# Altium schematic sheet [7] TSAL_Red.SchDoc
size A4
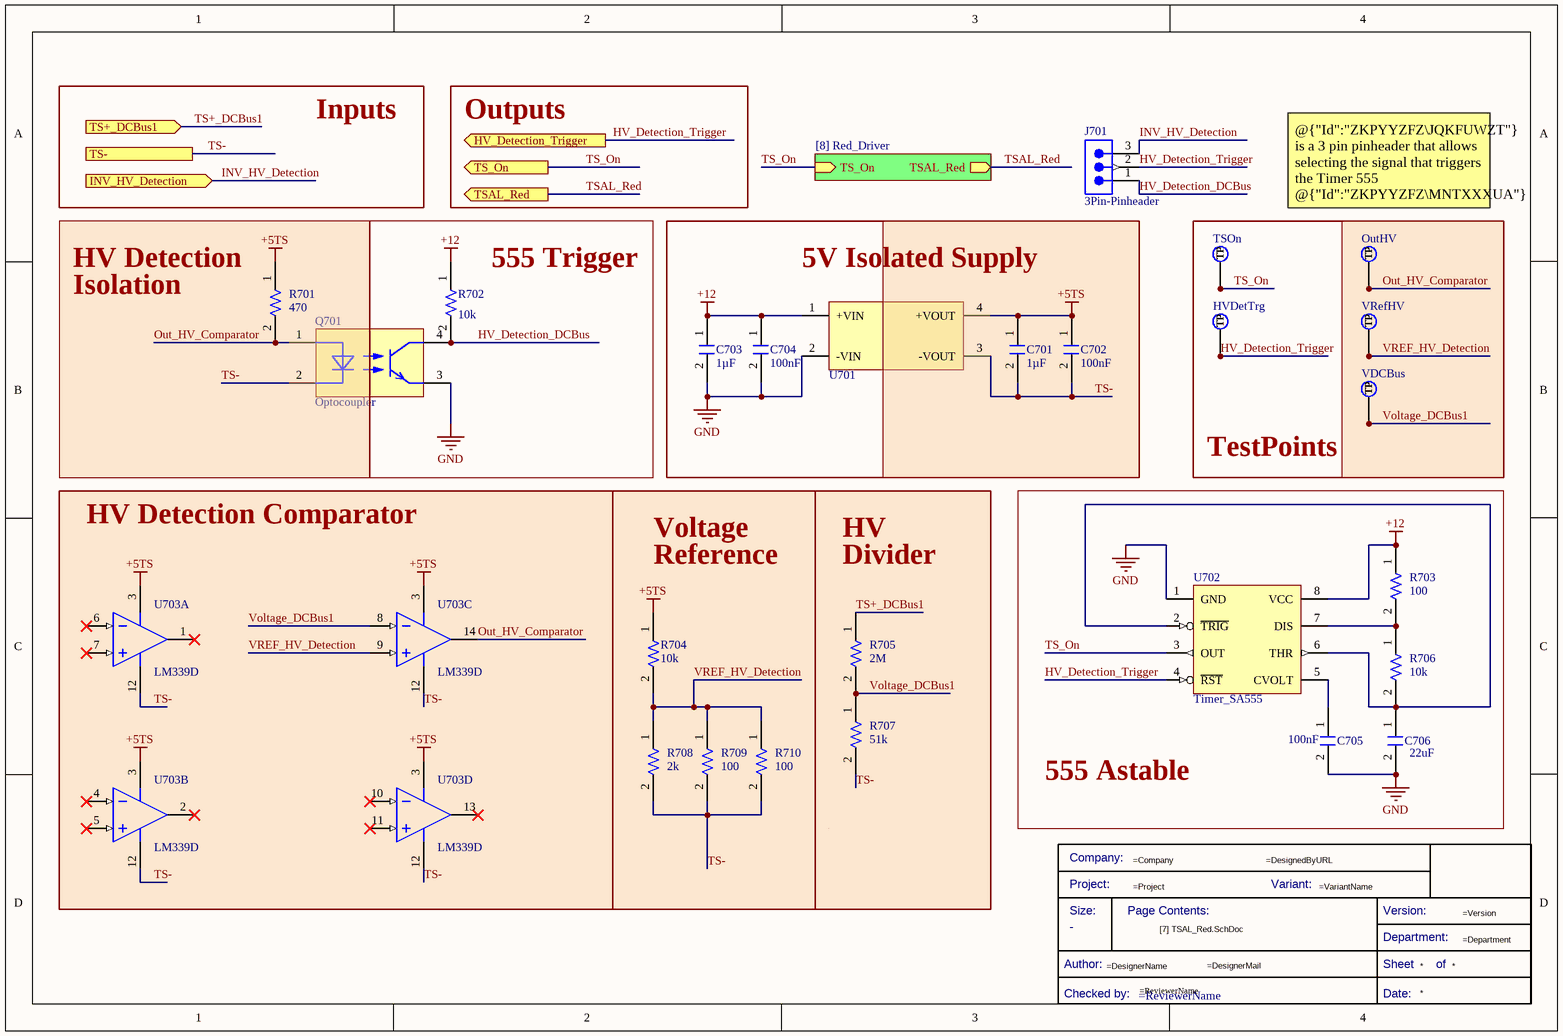
[diagram p0: [7] TSAL_Red.SchDoc]

## Parts
*  Title Block_template  (value not drawn)  (graphical)
C701  value 1µF  [C0805FNPC-R]  (hidden comment: C1u-50V-0805FNPC-X7R)
C702  Capacitance: 100nF  [WCAP-CSGP_0805_L2W1.25H0.8_Reflow]  (hidden comment: C100n-16V-0805)
C703  value 1µF  [C0805FNPC-R]  (hidden comment: C1u-50V-0805FNPC-X7R)
C704  Capacitance: 100nF  [WCAP-CSGP_0805_L2W1.25H0.8_Reflow]  (hidden comment: C100n-16V-0805)
C705  value 100nF  [WCAP-CSGP_0805_L2W1.25H0.8_Reflow]  (hidden comment: C100n-16V-0805)
C706  value 22uF  [WCAP-CSGP_0805_L2W1.25H0.8_Reflow]  (hidden comment: C22u-25V-0805)
HVDetTrg  TestPoint  [TestPoint]  (value not drawn)  (no BOM)
J701  3Pin-Pinheader  [61300311121]
OutHV  TestPoint  [TestPoint]  (value not drawn)  (no BOM)
Q701  Optocoupler  [WL-OCPT_LSOP4]
R701  value 470  [R0805FTK]  (hidden comment: R470-0805FTK)
R702  value 10k  [R0805FTK]  (hidden comment: R10k-0805FTK)
R703  value 100  [R0805FTK]  (hidden comment: R100-0805FTK)
R704  Resistance: 10k  [0805]  (hidden comment: R10k_0805_0.25W)
R705  Resistance: 2M  [R2512FTK]  (hidden comment: R2M-2512FTK)
R706  value 10k  [R0805FTK]  (hidden comment: R10k-0805FTK)
R707  value 51k  [0805]  (hidden comment: R51k_0805)
R708  value 2k  [0805]  (hidden comment: R2K_0.5W_0805)
R709  value 100  [R0805FTK]  (hidden comment: R100-0805FTK)
R710  value 100  [R0805FTK]  (hidden comment: R100-0805FTK)
TSOn  TestPoint  [TestPoint]  (value not drawn)  (no BOM)
U701  DCDC_ISO_12VIN_5VOUT  [WPME-FISM_SIP-7_L19.65W7.05H10.16]  (value not drawn)
U702  Timer_SA555  [Timer_SA555]
U703  LM339D  [D0014A_N]  (parts A,B,C,D of 4)
VDCBus  TestPoint  [TestPoint]  (value not drawn)  (no BOM)
VRefHV  TestPoint  [TestPoint]  (value not drawn)  (no BOM)

## Blocks framed on the sheet
555 Trigger: Q701 R702
5V Isolated Supply: C701-C704 U701
TestPoints: HVDetTrg OutHV TSOn VDCBus VRefHV
HV Detection Comparator: U703
555 Astable: C705 C706 R703 R706 U702

## Sub-sheets
Red Driver = [8] Red_Driver: TS_On (in), TSAL_Red (out)

## Ports
HV_Detection_Trigger (out, see TSAL_Control[1D], [1] TSAL_Green[2B], [2] Implausibilities[1A], [5] SCS[1A]), INV_HV_Detection (in, see TSAL_Control[1D]), TS+_DCBus1 (in, see TSAL_Control[1C]), TS- (see TSAL_Control[1D]), TS_On (out, see TSAL_Control[1D], [8] Red_Driver[1A]), TSAL_Red (out, see TSAL_Control[1C], [1] TSAL_Green[3A], [2] Implausibilities[1A], [5] SCS[1B], [8] Red_Driver[2A])

## Nets
+5TS: C701.1 C702.1 R701.1 R704.1 U701.4(+VOUT) U703.3(VCC)
+12: C703.1 C704.1 R702.1 R703.1 U701.1(+VIN) U702.8(VCC)
GND: C703.2 C704.2 C705.2 C706.2 Q701.3(Emitter) U701.2(-VIN) U702.1(GND)
HV_Detection_DCBus: J701.1 Q701.4(Collector) R702.2
HV_Detection_Trigger: HVDetTrg.1(TP) J701.2 U702.4(~{RST}) ; port HV_Detection_Trigger
INV_HV_Detection: J701.3 ; port INV_HV_Detection
Out_HV_Comparator: OutHV.1(TP) Q701.1(Anode) R701.2 U703.14(OUT3)
TS+_DCBus1: R705.1 ; port TS+_DCBus1
TS-: C701.2 C702.2 Q701.2(Cathode) R707.2 R708.2 R709.2 R710.2 U701.3(-VOUT) U703.12(GND) ; port TS-
TS_On: TSOn.1(TP) U702.3(OUT) ; port TS_On, sheet Red Driver/TS_On
TSAL_Red: port TSAL_Red, sheet Red Driver/TSAL_Red
Voltage_DCBus1: R705.2 R707.1 U703.8(IN3-) VDCBus.1(TP)
VREF_HV_Detection: R704.2 R708.1 R709.1 R710.1 U703.9(IN3+) VRefHV.1(TP)
NetC705_1: C705.1 U702.5(CVOLT)
NetC706_1: C706.1 R706.2 U702.2(~{TRIG}) U702.6(THR)
NetR703_2: R703.2 R706.1 U702.7(DIS)

Not connected (* = marked no-connect by the designer): U703 1(OUT1)* 2(OUT2)* 4(IN2-)* 5(IN2+)* 6(IN1-)* 7(IN1+)* 10(IN4-)* 11(IN4+)* 13(OUT4)*

## Notes on the sheet
- Inputs
- Outputs
- @{"Id":"ZKPYYZFZ\JQKFUWZT"} is a 3 pin pinheader that allows selecting the signal that triggers the Timer 555 @{"Id":"ZKPYYZFZ\MNTXXXUA"} to oscillate and drive the TSAL Red.
- (near R701) HV Detection
- Isolation
- Voltage
- Reference
- HV
- Divider
- (in symbol CMP-00043-8) Company:; Project:; Variant:; Size:; Page Contents:; Version:; Department:; Author:; Sheet; of; Checked by:; Date:

## Library data of the parts
* = CMP-00043-8: Standard Title Block; .SCHcheck: GP; Checked by:: =ReviewerName; Size: -; Design Item ID: Title Block_template; .PCBcheck: GP; .Creator: GP; Source: e-Tech_Racing.SchLib; Category: Title Block
C701 C703 = CMP-00052-2: Multilayer Ceramic Capacitor, Wcap-Csgp Series, 1 F, 10%, X7R, 50 V, 0805 [2012 Metric] Rohs Compliant: Yes; Manufacturer Part Number 1: 885012207103; Manufacturer 1: Wurth Electronics; Voltage Rating (DC): 50V; .Creator: GP; Max Operating Temperature: 85°C; Case/Package: 0805; ComponentLink1Description: http://www.farnell.com/datasheets/1958501.pdf?src-supplier=Farnell; Design Item ID: C1u-50V-0805FNPC-X7R; ComponentLink1URL: http://www.farnell.com/datasheets/1958501.pdf?src-supplier=Farnell; ComponentLink2Description: http://www.farnell.com/datasheets/1958501.pdf?src-supplier=Element14; ComponentLink3URL: https://katalog.we-online.de/pbs/datasheet/885012107003.pdf?src-supplier=Digi-Key; ComponentLink4Description: http://www.farnell.com/datasheets/1958501.pdf?src-supplier=Newark; Width: 0.049inch; RoHS Compliant: Yes; Case Code (Metric): 2012; Source: Passives.SchLib; Category: Ceramic Capacitors; Tolerance: 10%; Pricing 1: 50=0,27200, 250=0,25300, 500=0,22800, 1250=0,20100, 2500=0,17100 (GBP); RoHS: Yes; Mount: Surface Mount; Min Operating Temperature: -55°C; ComponentLink4URL: http://www.farnell.com/datasheets/1958501.pdf?src-supplier=Newark; Dielectric: X7R; ComponentLink3Description: https://katalog.we-online.de/pbs/datasheet/885012107003.pdf?src-supplier=Digi-Key; ComponentLink2URL: http://www.farnell.com/datasheets/1958501.pdf?src-supplier=Element14; REACH SVHC: Unknown; Length: 0.079inch; Packaging: Cut Tape; Thickness: 0.053inch; Stock 1: 5100; Voltage Rating: 50V
C702 C704 C705 = CMP-001-00008-6: Ceramic Capacitor, Multilayer, Ceramic, 16V, 10% +Tol, 10% -Tol, X7R, 15% TC, 0.1uF, Surface Mount, 0805; Pins: 2; RoHS Compliant: Yes; Capacitor Type: Ceramic
C706 = CMP-001-00017-4: 885012107019
HVDetTrg OutHV TSOn VDCBus VRefHV = CMP-00042-2: Test Point 1x1 mm; .SCHcheck: GP; Category: TestPoint; Source: e-Tech_Racing.SchLib; .Creator: GP; .PCBcheck: GP; Design Item ID: TestPoint
J701 = CMP-002-00009-1: Board Connector, 3 Contact(s), 1 Row(s), Male, Straight, 0.1 inch Pitch, Solder Terminal, Locking, Black Insulator, Plug; RoHS Compliant: Yes; Connector Type: BOARD CONNECTOR; Max Operating Temperature: 125°C; Min Operating Temperature: -40°C; Mounting Technology: Board
Q701 = CMP-00195-1: Transistor Output Optocoupler. S/N: 140100146000; RoHS Compliant: Yes
R701 = CMP-00093-3: Res Thick Film 0805 470 Ohm 1% 1/8W ±100ppm/°C Molded SMD SMD Paper Tape on Plastic Reel; Manufacturer Part Number 1: CR0805-FX-4700GLF; Manufacturer 1: Bourns; Voltage Rating (DC): 150V; Max Power Dissipation: 125mW; .Creator: DR; ComponentLink2URL: https://datasheet.ciiva.com/7985/1856384-7985880.pdf?src-supplier=Element14; Construction: Rectangular; Max Operating Temperature: 155°C; Thickness: 508um; Pins: 2; REACH SVHC: No SVHC; Features: Moisture Resistant; Voltage Rating: 150V; Source: Passives.SchLib; Pricing 1: 1=0,00990, 10=0,00980, 25=0,00950, 50=0,00940, 100=0,00930, 250=0,00920, 500=0,00910, 1000=0,00890, 3000=0,00870, 6000=0,00860 (USD); ComponentLink4URL: https://datasheet.ciiva.com/5541/chpreztr-5541930.pdf?src-supplier=Mouser; Design Item ID: R470-0805FTK; Depth: 1.25mm; Case Code (Metric): 2012; Technology: THICK FILM; RoHS: Yes; Power Rating: 125mW; Number of Terminations: 2; ComponentLink1URL: https://datasheet.ciiva.com/11808/0900766b80fcdb72-11808686.pdf?src-supplier=RSComponents; Tolerance: 1%; Radiation Hardening: No; Packaging: Tape and Reel; Resistor Type: Thick Film; Series: CR0805; Military Standard: Not; Termination: SMD/SMT; ComponentLink3URL: https://datasheet.ciiva.com/22693/1902866-22693247.pdf?src-supplier=Element14; Min Operating Temperature: -55°C; ComponentLink4Description: https://datasheet.ciiva.com/5541/chpreztr-5541930.pdf?src-supplier=Mouser; ComponentLink3Description: https://datasheet.ciiva.com/22693/1902866-22693247.pdf?src-supplier=Element14; Stock 1: 12623; Length: 2mm; Temperature Coefficient: 100ppm/°C; Contact Plating: Tin; ComponentLink1Description: https://datasheet.ciiva.com/11808/0900766b80fcdb72-11808686.pdf?src-supplier=RSComponents; Case/Package: 0805; Category: Chip SMD Resistors; ComponentLink2Description: https://datasheet.ciiva.com/7985/1856384-7985880.pdf?src-supplier=Element14; Height: 0.5mm; Mount: Surface Mount; Resistance Tolerance: 1%
R702 R706 = CMP-00085-4: BOURNS         CR0805-JW-103ELF            Surface Mount Chip Resistor, Thick Film, CR Series, 10 kohm, 125 mW,  5%, 150 V; .Creator: DR; Power Rating: 125mW; Voltage Rating (DC): 100V; Voltage Rating: 150V; Temperature Coefficient: 200ppm/°C; ComponentLink6URL: https://datasheet.ciiva.com/16783/70154685-16783482.pdf?src-supplier=Allied+Electronics; Manufacturer 1: Bourns; Package Quantity: 1; ComponentLink10URL: https://datasheet.ciiva.com/7985/1856384-7985869.pdf?src-supplier=Element14; Technology: THICK FILM; Source: Passives.SchLib; RoHS Compliant: Yes; ComponentLink10Description: https://datasheet.ciiva.com/7985/1856384-7985869.pdf?src-supplier=Element14; ComponentLink1URL: https://datasheet.ciiva.com/11821/0900766b80fcdb72-11821135.pdf?src-supplier=RSComponents; ComponentLink7Description: https://datasheet.ciiva.com/5548/chpreztr-5548491.pdf?src-supplier=Mouser; Radiation Hardening: No; Design Item ID: R10k-0805FTK; ComponentLink4Description: https://datasheet.ciiva.com/7986/691949-7986187.pdf?src-supplier=Element14; Pins: 2; ComponentLink9URL: https://datasheet.ciiva.com/6559/chpreztr-6559901.pdf?src-supplier=Digi-Key; Resistor Type: Thick Film; ComponentLink4URL: https://datasheet.ciiva.com/7986/691949-7986187.pdf?src-supplier=Element14; Contact Plating: Tin; Case Code (Metric): 2012; Military Standard: Not; Depth: 1.25mm; Case/Package: 0805; Packaging: Tape and Reel; ComponentLink9Description: https://datasheet.ciiva.com/6559/chpreztr-6559901.pdf?src-supplier=Digi-Key; Construction: Rectangular; Pricing 1: 1=0,05790, 10=0,01540, 25=0,01340, 100=0,00340 (USD); ComponentLink7URL: https://datasheet.ciiva.com/5548/chpreztr-5548491.pdf?src-supplier=Mouser; Category: Chip SMD Resistors; Length: 2mm; Max Operating Temperature: 155°C; Resistance Tolerance: 5%; Manufacturer Part Number 1: CR0805-JW-103ELF; Height: 0.5mm; ComponentLink2URL: https://datasheet.ciiva.com/9122/chpreztr-9122374.pdf?src-supplier=Avnet; Thickness: 508um; Max Power Dissipation: 125mW; ComponentLink8Description: https://datasheet.ciiva.com/6559/chpreztr-6559900.pdf?src-supplier=Digi-Key; REACH SVHC: No SVHC; ComponentLink8URL: https://datasheet.ciiva.com/6559/chpreztr-6559900.pdf?src-supplier=Digi-Key; ComponentLink5URL: https://datasheet.ciiva.com/30065/159chpreztr-30065976.pdf?src-supplier=Onlinecomponents.com; Width: 1.25mm; ComponentLink11URL: https://datasheet.ciiva.com/48692/001055517-da-01-en-smd-wid-cr0805-jw-103elf-10k-ohm-1-8w-48692118.pdf?src-supplier=Conrad; ComponentLink3Description: https://datasheet.ciiva.com/22693/1902866-22693254.pdf?src-supplier=Element14; ComponentLink11Description: https://datasheet.ciiva.com/48692/001055517-da-01-en-smd-wid-cr0805-jw-103elf-10k-ohm-1-8w-48692118.pdf?src-supplier=Conrad; ComponentLink1Description: https://datasheet.ciiva.com/11821/0900766b80fcdb72-11821135.pdf?src-supplier=RSComponents; ComponentLink2Description: https://datasheet.ciiva.com/9122/chpreztr-9122374.pdf?src-supplier=Avnet; Stock 1: 57566; Min Operating Temperature: -55°C; Series: CR0805; Number of Terminations: 2; Termination: SMD/SMT; Tolerance: 5%; Mount: Surface Mount; ComponentLink6Description: https://datasheet.ciiva.com/16783/70154685-16783482.pdf?src-supplier=Allied+Electronics; ComponentLink5Description: https://datasheet.ciiva.com/30065/159chpreztr-30065976.pdf?src-supplier=Onlinecomponents.com; RoHS: Yes; Features: Moisture Resistant; ComponentLink3URL: https://datasheet.ciiva.com/22693/1902866-22693254.pdf?src-supplier=Element14
R703 = CMP-00083-3: Res Thick Film 0805 100 Ohm 1% 1/8W ±100ppm/°C Molded SMD SMD Paper Tape on Plastic Reel; Manufacturer Part Number 1: CR0805-FX-1000ELF; Manufacturer 1: Bourns; Power Rating: 125mW; Voltage Rating (DC): 150V; .Creator: DR; Military Standard: Not; Radiation Hardening: No; Max Operating Temperature: 155°C; Packaging: Tape and Reel; ComponentLink3Description: https://datasheet.ciiva.com/6547/chpreztr-6547414.pdf?src-supplier=Digi-Key; RoHS Compliant: Yes; ComponentLink5Description: https://datasheet.ciiva.com/9120/chpreztr-9120744.pdf?src-supplier=Avnet; ComponentLink4URL: https://datasheet.ciiva.com/6547/chpreztr-6547415.pdf?src-supplier=Digi-Key; REACH SVHC: No SVHC; Depth: 1.25mm; Case/Package: 0805; Series: CR0805; Pricing 1: 1=0,05840, 10=0,03430, 25=0,01780, 100=0,00750, 250=0,00560, 500=0,00490, 3000=0,00470 (USD); Features: Moisture Resistant; Design Item ID: R100-0805FTK; Resistor Type: Thick Film; ComponentLink3URL: https://datasheet.ciiva.com/6547/chpreztr-6547414.pdf?src-supplier=Digi-Key; Construction: Rectangular; Width: 1.25mm; ComponentLink4Description: https://datasheet.ciiva.com/6547/chpreztr-6547415.pdf?src-supplier=Digi-Key; Stock 1: 49802; ComponentLink1URL: https://datasheet.ciiva.com/11809/0900766b80fcdb72-11809178.pdf?src-supplier=RSComponents; Number of Terminations: 2; ComponentLink1Description: https://datasheet.ciiva.com/11809/0900766b80fcdb72-11809178.pdf?src-supplier=RSComponents; Length: 2mm; Min Operating Temperature: -55°C; Height: 0.5mm; Mount: Surface Mount; Max Power Dissipation: 125mW; Technology: THICK FILM; Case Code (Metric): 2012; Tolerance: 1%; Category: Chip SMD Resistors; Thickness: 508um; Source: Passives.SchLib; Resistance Tolerance: 1%; RoHS: Yes; ComponentLink5URL: https://datasheet.ciiva.com/9120/chpreztr-9120744.pdf?src-supplier=Avnet; Temperature Coefficient: 100ppm/°C; Package Quantity: 1; Pins: 2; Contact Plating: Tin; Voltage Rating: 150V; Termination: SMD/SMT; ComponentLink2Description: https://datasheet.ciiva.com/6547/chpreztr-6547413.pdf?src-supplier=Digi-Key; ComponentLink2URL: https://datasheet.ciiva.com/6547/chpreztr-6547413.pdf?src-supplier=Digi-Key
R704 = CMP-009-00035-5: Resistor, 10K, 0.25W, Thick Film, 0805 Rohs Compliant: Yes
R705 = CMP-00108-3: Current Sense Resistors - SMD 3watts .002ohms 1%; Manufacturer: Vishay Dale; Manufacturer Part Number: WSLP25122L000FEA; Power Rating: 3W; Temperature Coefficient: 275ppm/°C; Packaging: Tape and Reel; Height: 0.635mm; Weight: 0.001429oz; Case Code (Imperial): 2512; Source: Passives.SchLib; Tolerance: 1%; Termination: SMD/SMT; RoHS: Yes; Size Code: 2512; Case Code (Metric): 6432; Stock 1: 11994; ComponentLink1URL: https://datasheet.ciiva.com/48527/wslp-48527354.pdf?src-supplier=Avnet; Package Quantity: 2000; Length: 6.4mm; Resistor Type: Metal Strip; ComponentLink1Description: https://datasheet.ciiva.com/48527/wslp-48527354.pdf?src-supplier=Avnet; Design Item ID: R2M-2512FTK; Mount: Surface Mount; Width: 3.2mm; Category: Chip SMD Resistors; RoHS Compliant: Yes; Case/Package: 2512; Max Operating Temperature: 170°C; Lead Free: Lead Free; Pricing 1: 1=1,07000, 10=1,07000, 50=1,07000, 100=1,07000, 1000=0,77100, 10000=0,75500 (USD); Series: WSLP; Min Operating Temperature: -65°C
R707 = CMP-009-00018-5: Fixed Resistor, Metal Glaze/thick Film, 0.125W, 51000ohm, 150V, 1% +/-Tol, 100ppm/Cel, Surface Mount, 0805. ERJ-6ENF5102V; Power: 125mW; Mounting Technology: Surface Mount; Pins: 2; Case/Package: 0805; RoHS Compliant: Yes; Tolerance: 1%; Min Operating Temperature: -55°C; Max Operating Temperature: 155°C
R708 = CMP-009-00027-3: Fixed Resistor, Metal Glaze/thick Film, 0.5W, 2000ohm, 150V, 1% +/-Tol, 100ppm/Cel, Surface Mount, 0805; Manufacturer: Vishay; Part Number: CRCW08052K00FKEAHP; Power: 500mW; Min Operating Temperature: -55°C; Max Operating Temperature: 155°C; RoHS Compliant: Yes; Tolerance: 1%; Mounting Technology: Surface Mount; Pins: 2; Case/Package: 0805
R709 R710 = CMP-00083-3: Res Thick Film 0805 100 Ohm 1% 1/8W ±100ppm/°C Molded SMD SMD Paper Tape on Plastic Reel; Manufacturer 1: Bourns; Manufacturer Part Number 1: CR0805-FX-1000ELF; .Creator: DR; Voltage Rating: 150V; Power Rating: 125mW; Stock 1: 49802; Category: Chip SMD Resistors; Number of Terminations: 2; RoHS Compliant: Yes; Package Quantity: 1; Case/Package: 0805; Features: Moisture Resistant; Source: Passives.SchLib; Military Standard: Not; Construction: Rectangular; RoHS: Yes; Packaging: Tape and Reel; ComponentLink3URL: https://datasheet.ciiva.com/6547/chpreztr-6547414.pdf?src-supplier=Digi-Key; Resistance Tolerance: 1%; Termination: SMD/SMT; Height: 0.5mm; Radiation Hardening: No; Pricing 1: 1=0,05840, 10=0,03430, 25=0,01780, 100=0,00750, 250=0,00560, 500=0,00490, 3000=0,00470 (USD); ComponentLink2URL: https://datasheet.ciiva.com/6547/chpreztr-6547413.pdf?src-supplier=Digi-Key; ComponentLink5Description: https://datasheet.ciiva.com/9120/chpreztr-9120744.pdf?src-supplier=Avnet; Pins: 2; ComponentLink4URL: https://datasheet.ciiva.com/6547/chpreztr-6547415.pdf?src-supplier=Digi-Key; Temperature Coefficient: 100ppm/°C; Resistor Type: Thick Film; ComponentLink3Description: https://datasheet.ciiva.com/6547/chpreztr-6547414.pdf?src-supplier=Digi-Key; Width: 1.25mm; ComponentLink4Description: https://datasheet.ciiva.com/6547/chpreztr-6547415.pdf?src-supplier=Digi-Key; Length: 2mm; ComponentLink5URL: https://datasheet.ciiva.com/9120/chpreztr-9120744.pdf?src-supplier=Avnet; Case Code (Metric): 2012; Design Item ID: R100-0805FTK; ComponentLink1Description: https://datasheet.ciiva.com/11809/0900766b80fcdb72-11809178.pdf?src-supplier=RSComponents; ComponentLink1URL: https://datasheet.ciiva.com/11809/0900766b80fcdb72-11809178.pdf?src-supplier=RSComponents; Thickness: 508um; ComponentLink2Description: https://datasheet.ciiva.com/6547/chpreztr-6547413.pdf?src-supplier=Digi-Key; Series: CR0805; Min Operating Temperature: -55°C; REACH SVHC: No SVHC; Technology: THICK FILM; Contact Plating: Tin; Tolerance: 1%; Max Operating Temperature: 155°C; Max Power Dissipation: 125mW; Voltage Rating (DC): 150V; Depth: 1.25mm; Mount: Surface Mount
U701 = CMP-019-00001-3: WPME-FISM Fixed Isolated SIP/SMT Module
U702 = CMP-00181-3: Precision timer for -55 to 85C operation 8-SOIC -40 to 85; Manufacturer Part Number: SA555D; Manufacturer: Texas Instruments; Max Supply Voltage: 16V; Quiescent Current: 15mA; Min Supply Voltage: 4.5V; Low Level Output Current: 200mA; Frequency: 500kHz; Nominal Supply Current: 2mA; Number of Timers/Counters: 1; .Creator: DO; Operating Supply Current: 10mA; High Level Output Current: -200mA; ComponentLink4Description: https://datasheet.ciiva.com/1139/1851962-1139987.pdf?src-supplier=Element14; Mount: Surface Mount; ComponentLink4URL: https://datasheet.ciiva.com/1139/1851962-1139987.pdf?src-supplier=Element14; Packaging: Rail/Tube; Radiation Hardening: No; ComponentLink5URL: https://datasheet.ciiva.com/15152/getdatasheetpartid-75292-15152565.pdf?src-supplier=Verical; ComponentLink2Description: https://datasheet.ciiva.com/14094/ne555-series-eng-tds-14094951.pdf?src-supplier=Distrelec; ComponentLink3Description: https://datasheet.ciiva.com/1233/sa555-1233455.pdf?src-supplier=Digi-Key; Contact Plating: Gold; ComponentLink1Description: https://datasheet.ciiva.com/1147/na555-1147816.pdf?src-supplier=Newark; Weight: 0.002561oz; Height: 1.58mm; Min Operating Temperature: -40°C; Package Quantity: 75; ComponentLink6Description: Where buy it; Design Item ID: Timer_SA555; Case/Package: SOIC; Lead Free: Lead Free; ComponentLink6URL: https://www.mouser.es/ProductDetail/Texas-Instruments/SA555D?qs=gb35HGp1gQJkvy2FEVqR%2Fw%3D%3D; Category: Timers and Oscillators; ComponentLink1URL: https://datasheet.ciiva.com/1147/na555-1147816.pdf?src-supplier=Newark; ComponentLink2URL: https://datasheet.ciiva.com/14094/ne555-series-eng-tds-14094951.pdf?src-supplier=Distrelec; REACH SVHC: No SVHC; Max Operating Temperature: 85°C; Number of Pins: 8; Length: 4.9mm; ComponentLink5Description: https://datasheet.ciiva.com/15152/getdatasheetpartid-75292-15152565.pdf?src-supplier=Verical; RoHS Compliant: Yes; Stock 1: 1162; Pricing 1: 1=0,93000, 10=0,83500, 25=0,79240, 100=0,65090, 250=0,60848, 500=0,53774, 1000=0,46725 (USD); ComponentLink3URL: https://datasheet.ciiva.com/1233/sa555-1233455.pdf?src-supplier=Digi-Key; RoHS: Yes; Width: 3.91mm; Source: Integrated circuits.SchLib
U703 = CMP-014-00006-1: Comparator, 4 Func, 5000uV Offset-Max, 300ns Response Time, BIPolar, PDSO14; Nominal Supply Voltage: 5V; Channels: 4; Output Type: OPEN-COLLECTOR; Case/Package: SOP; Pins: 14; Max Operating Temperature: 70°C; Min Operating Temperature: 0°C; RoHS Compliant: Yes